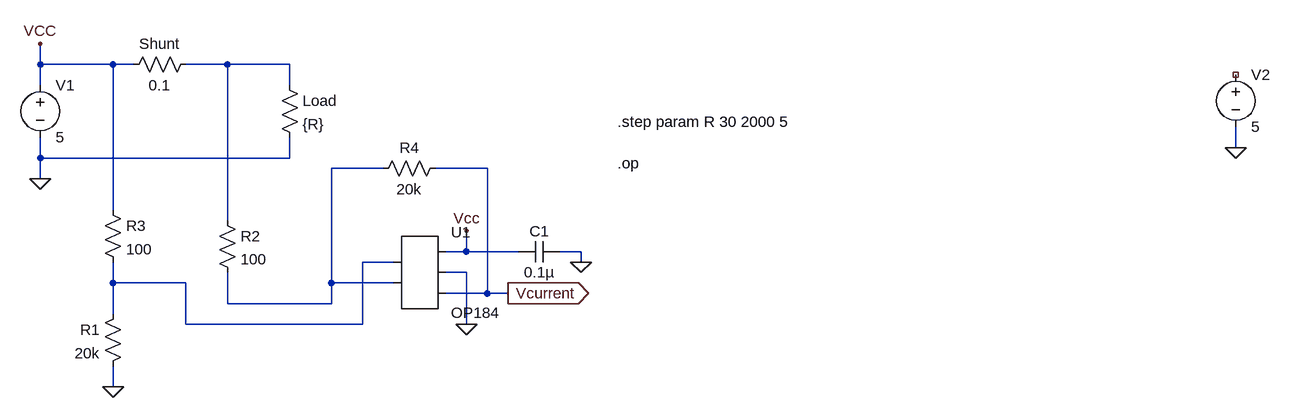
[diagram p0: schematic Draft1.asc]
* Draft1.asc
R§Shunt N001 Vcc 0.1
V1 Vcc 0 5
R§Load N001 0 {R}
C1 0 Vcc 0.1µ
R1 N003 0 20k
R2 N001 N002 100
R3 Vcc N003 100
R4 Vcurrent N002 20k
V2 NC_01 0 5
* U1: OP184 (symbol AutoGenerated\OP184 not available, pins judged from their places): pin1=N003 pin2=N002 pin3=Vcc pin4=0 pin5=Vcurrent
.op
.step param R 30 2000 5
.backanno
.end

* Results of the author's LTspice run, read from the files saved beside the schematic
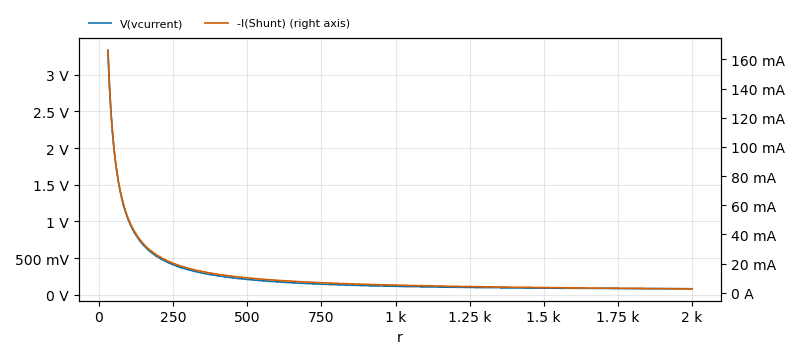
[diagram p1: Operating Point of Draft1.asc, plotted from the saved traces]
* Operating Point, 1 run:
*   V(vcurrent): 3.33 V at r=30 , 83.53 mV at r=2 k, min 83.53 mV, max 3.33 V
*   -I(Shunt): 166.2 mA at r=30 , 2.745 mA at r=2 k, min 2.745 mA, max 166.2 mA